# Altium schematic sheet Altium_v0.6.2.SchDoc
size A4
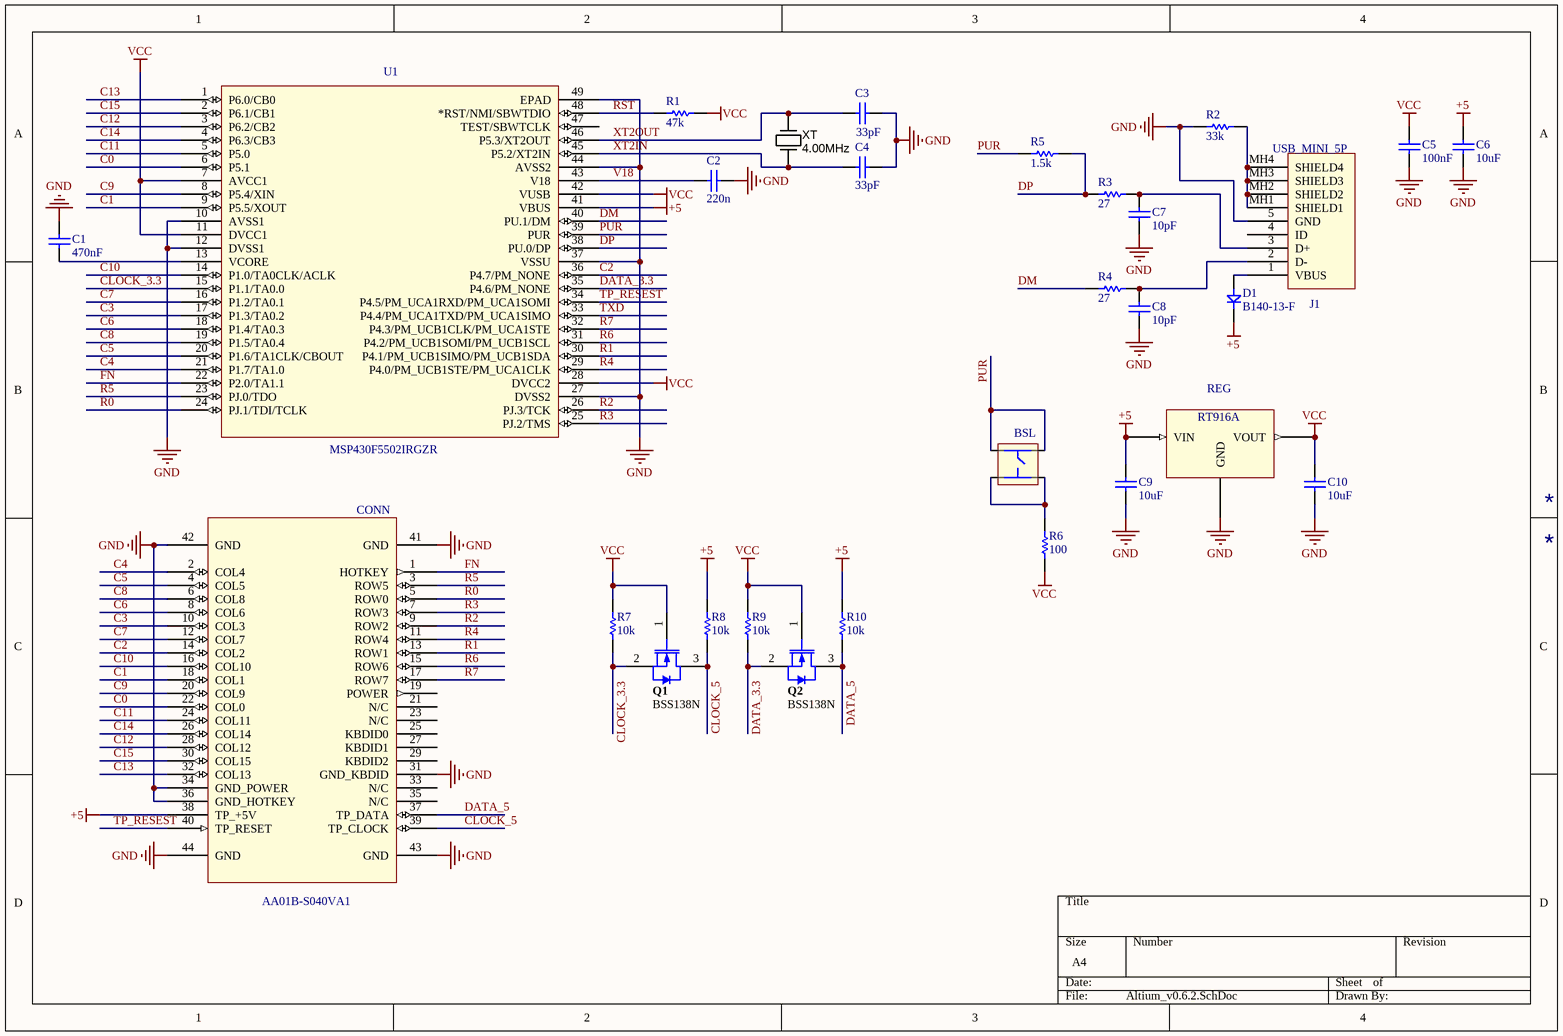
[diagram p0: Altium_v0.6.2.SchDoc]

## Parts
BSL  TL3301  [TL3301]  (value not drawn)
C1  value 470nF  [C0805]  (hidden comment: Cap)
C2  value 220n  [C0805]  (hidden comment: Cap)
C3  value 33pF  [C0805]  (hidden comment: Cap)
C4  value 33pF  [C0805]  (hidden comment: Cap)
C5  value 100nF  [C0805]  (hidden comment: Cap)
C6  value 10uF  [C0805]  (hidden comment: Cap)
C7  value 10pF  [C0805]  (hidden comment: Cap)
C8  value 10pF  [C0805]  (hidden comment: Cap)
C9  value 10uF  [C0805]  (hidden comment: Cap)
C10  value 10uF  [C0805]  (hidden comment: Cap)
CONN  AA01B-S040VA1  [AA01B-S040VA1]
D1  B140-13-F  [SMA]
J1  USB_MINI_5P  [USB_Mini-B_Molex_SMT]
Q1  BSS138N  [INF-PG-SOT23_N]
Q2  BSS138N  [INF-PG-SOT23_N]
R1  value 47k  [C0805]  (hidden comment: Res1)
R2  value 33k  [C0805]  (hidden comment: Res1)
R3  value 27  [C0805]  (hidden comment: Res1)
R4  value 27  [C0805]  (hidden comment: Res1)
R5  value 1.5k  [C0805]  (hidden comment: Res1)
R6  value 100  [C0805]  (hidden comment: Res1)
R7  value 10k  [C0805]  (hidden comment: Res1)
R8  value 10k  [C0805]  (hidden comment: Res1)
R9  value 10k  [C0805]  (hidden comment: Res1)
R10  value 10k  [C0805]  (hidden comment: Res1)
REG  RT9164A LDO  [SOT223]  (value not drawn)
U1  MSP430F5502IRGZR  [RGZ48_5P15X5P15]
XT  4.00MHz  [CRYSTAL_HC49-US-SM]

## Nets
+5: C6.2 C9.2 CONN.38(TP_+5V) D1.2 R8.2 R10.2 REG.3(VIN) U1.41(VBUS)
GND: C1.2 C2.1 C3.1 C4.2 C5.1 C6.1 C7.1 C8.1 C9.1 C10.1 CONN.31(GND_KBDID) CONN.34(GND_POWER) CONN.36(GND_HOTKEY) CONN.41(GND) CONN.42(GND) CONN.43(GND) CONN.44(GND) J1.5(GND) R2.2 REG.1(GND) U1.10(AVSS1) U1.12(DVSS1) U1.27(DVSS2) U1.37(VSSU) U1.44(AVSS2) U1.49(EPAD)
VCC: C5.2 C10.2 Q1.1(GATE) Q2.1(GATE) R1.2 R6.1 R7.2 R9.2 REG.2(VOUT) U1.7(AVCC1) U1.11(DVCC1) U1.28(DVCC2) U1.42(VUSB)
C0: CONN.22(COL0) U1.6(P5.1)
C1: CONN.18(COL1) U1.9(P5.5/XOUT)
C2: CONN.14(COL2) U1.36(P4.7/PM_NONE)
C3: CONN.10(COL3) U1.17(P1.3/TA0.2)
C4: CONN.2(COL4) U1.21(P1.7/TA1.0)
C5: CONN.4(COL5) U1.20(P1.6/TA1CLK/CBOUT)
C6: CONN.8(COL6) U1.18(P1.4/TA0.3)
C7: CONN.12(COL7) U1.16(P1.2/TA0.1)
C8: CONN.6(COL8) U1.19(P1.5/TA0.4)
C9: CONN.20(COL9) U1.8(P5.4/XIN)
C10: CONN.16(COL10) U1.14(P1.0/TA0CLK/ACLK)
C11: CONN.24(COL11) U1.5(P5.0)
C12: CONN.28(COL12) U1.3(P6.2/CB2)
C13: CONN.32(COL13) U1.1(P6.0/CB0)
C14: CONN.26(COL14) U1.4(P6.3/CB3)
C15: CONN.30(COL15) U1.2(P6.1/CB1)
CLOCK_3.3: Q1.2(SOURCE) R7.1 U1.15(P1.1/TA0.0)
CLOCK_5: CONN.39(TP_CLOCK) Q1.3(DRAIN) R8.1
DATA_3.3: Q2.2(SOURCE) R9.1 U1.35(P4.6/PM_NONE)
DATA_5: CONN.37(TP_DATA) Q2.3(DRAIN) R10.1
DM: R4.1 U1.40(PU.1/DM)
DP: R3.1 R5.2 U1.38(PU.0/DP)
FN: CONN.1(HOTKEY) U1.22(P2.0/TA1.1)
PUR: BSL.1 BSL.2 R5.1 U1.39(PUR)
R0: CONN.5(ROW0) U1.24(PJ.1/TDI/TCLK)
R1: CONN.13(ROW1) U1.30(P4.1/PM_UCB1SIMO/PM_UCB1SDA)
R2: CONN.9(ROW2) U1.26(PJ.3/TCK)
R3: CONN.7(ROW3) U1.25(PJ.2/TMS)
R4: CONN.11(ROW4) U1.29(P4.0/PM_UCB1STE/PM_UCA1CLK)
R5: CONN.3(ROW5) U1.23(PJ.0/TDO)
R6: CONN.15(ROW6) U1.31(P4.2/PM_UCB1SOMI/PM_UCB1SCL)
R7: CONN.17(ROW7) U1.32(P4.3/PM_UCB1CLK/PM_UCA1STE)
RST: R1.1 U1.48(*RST/NMI/SBWTDIO)
TP_RESEST: CONN.40(TP_RESET) U1.34(P4.5/PM_UCA1RXD/PM_UCA1SOMI)
TXD: U1.33(P4.4/PM_UCA1TXD/PM_UCA1SIMO)
V18: C2.2 U1.43(V18)
XT2IN: C4.1 U1.45(P5.2/XT2IN) XT.1(IN)
XT2OUT: C3.2 U1.46(P5.3/XT2OUT) XT.2(OUT)
NetBSL_3: BSL.3 BSL.4 R6.2
NetC1_1: C1.1 U1.13(VCORE)
NetC7_2: C7.2 J1.3(D+) R3.2
NetC8_2: C8.2 J1.2(D-) R4.2
NetD1_1: D1.1 J1.1(VBUS)
NetJ1_MH1: J1.MH1(SHIELD1) J1.MH2(SHIELD2) J1.MH3(SHIELD3) J1.MH4(SHIELD4) R2.1

Not connected (* = marked no-connect by the designer): CONN 19(POWER) 21(N/C) 23(N/C) 25(KBDID0) 27(KBDID1) 29(KBDID2) 33(N/C) 35(N/C); J1 4(ID); U1 47(TEST/SBWTCLK)

## Notes on the sheet
- (in symbol RT9164A LDO) RT916A

## Library data of the parts
BSL = TL3301: TL3301, tactile switch, gull wing termination
C1-C10 = Cap: Capacitor; Published: 8-Jun-2000; LatestRevisionDate: 17-Jul-2002; LatestRevisionNote: Re-released for DXP Platform.; PackageReference: RAD-0.3; Publisher: Altium Limited; PackageDescription: Radial Cap, Thru-Hole; 2 Leads; 0.3 in Pin Spacing
CONN = AA01B-S040VA1: AA01B-S040VA1, LAPTOP KEYBOARD RECEPTACLE
D1 = B140-13-F: B140-13-F, Schottky Diode; Configuration: Single; Maximum continuous forward current: 1A; Peak Forward Voltage: 0.5V; Peak Non-Repetitive Forward Surge Current: 0.03kA; Peak Reverse Current: 10mA; Peak Reverse Repetitive Voltage: 40V; Dimension: 4.6 x 2.92 x 2.1mm; Type: Schottky; Height: 2.1mm; Length: 4.6mm; Package Type: SMA; Pin Count: 2; Width: 2.92mm
J1 = USB_MINI_5P: Mini USB Connector
Q1 Q2 = BSS138N: N-Channel SIPMOS Small-Signal-Transistor, 60 V VDS, 0.23 A ID, -55 to 150 degC, PG-SOT23, Reel, Green; Manufacturer: Infineon; Green: TRUE; ID (max): 0.23 A; IDpuls (max): 0.92 A; Ptot (max): 0.36 W; QG: 1 nC; RDS (on) (max): 3,500 mOhm; RDS (on) (max) (@4.5V): 6,000 mOhm; RthJA (max): 350 K/W; VDS (max): 60 V; VGS(th) (max): 1.4 V; VGS(th) (min): 0.6 V; DatasheetVersion: Rev. 2.86; PackageVersion: Apr-08; PackageReference: PG-SOT23; PackageDescription: 3-Pin Small Outline Transistor Package, 2.9 x 1.3 mm Body, 0.95 mm Pitch; Supplier 1: Farnell; Supplier Part Number 1: 1156434; Supplier 2: Farnell; Supplier Part Number 2: 1156434RL; Supplier 3: Newark; Supplier Part Number 3: 25M7814; Halogen-free: TRUE; Packing: Reel; Mounting Technology: Surface Mount; PartNumber: BSS138N; ComponentLink1Description: Manufacturer URL; ComponentLink1URL: http://www.infineon.com/; ComponentLink2Description: Datasheet; ComponentLink2URL: http://www.infineon.com/dgdl/BSS138N_Rev2.86_.pdf?folderId=db3a3043156fd573011622e10b5c1f67&fileId=db3a304330f68606013104d944d53efb; ComponentLink3Description: Package Specification; ComponentLink3URL: http://www.infineon.com/dgdl/SOT23-Package_Overview.pdf?folderId=db3a30431936bc4b0119532290053c66&fileId=db3a30431936bc4b0119533468123c85
R1-R10 = Res1: Resistor; Published: 8-Jun-2000; LatestRevisionDate: 17-Jul-2002; LatestRevisionNote: Re-released for DXP Platform.; PackageReference: AXIAL-0.3; Publisher: Altium Limited; PackageDescription: Axial Device, Thru-Hole; 2 Leads; 0.3 in Pin Spacing
REG = RT9164A LDO: RT9164-33[P/G]G, 3.3V, LDO
U1 = MSP430F5502_RGZ_: MSP430F5502; Manufacturer_Part_Number: msp430f5502_rgz_48; Vendor: Texas Instruments; PACKAGE_DESIGNATOR: RGZ; PIN_COUNT: 48; FAMILY_NAME: 5 Series; INDUSTRY_STD_PKG_TYPE: VQFN; GENERIC_PART_NUMBER: MSP430F5502; Datasheet URL: http://www.ti.com/lit/gpn/MSP430F5502; Manufacturer: Texas Instruments; RefDes: RefDes; Type: DEV; Value: Value
XT = Crystal_6MHz_HC49/US: Resonator Ceramic 6.00 MHz 30ppm; Manufacturer 1: CTS-Frequency Controls; Manufacturer Part Number 1: ATS060BSM-1; Frequency: 6MHz; Frequency Stability: ±50ppm; Load Capacitance: 18pF; Operating Mode: Fundamental; Parameter Name: 0.169" (4.30mm); SCDType: spec; Package / Case: HC49/US-SM; Ratings: 6.00 MHz; Supplier 1: Digi-Key; Supplier Part Number 1: CTX882CT-ND; Type: MHz Crystal; Frequency Tolerance: ±30ppm; Operating Temperature: -20°C ~ 70°C; Mounting Type: Surface Mount; Size / Dimension: 0.437" L x 0.190" W (11.10mm x 4.83mm); ComponentLink1URL: http://www.ctscorp.com/components/Datasheets/008-0309-0.pdf; ComponentLink1Description: http://www.ctscorp.com/components/Datasheets/008-0309-0.pdf